# EAGLE design untitledunfinished (EAGLE 9.4.2)
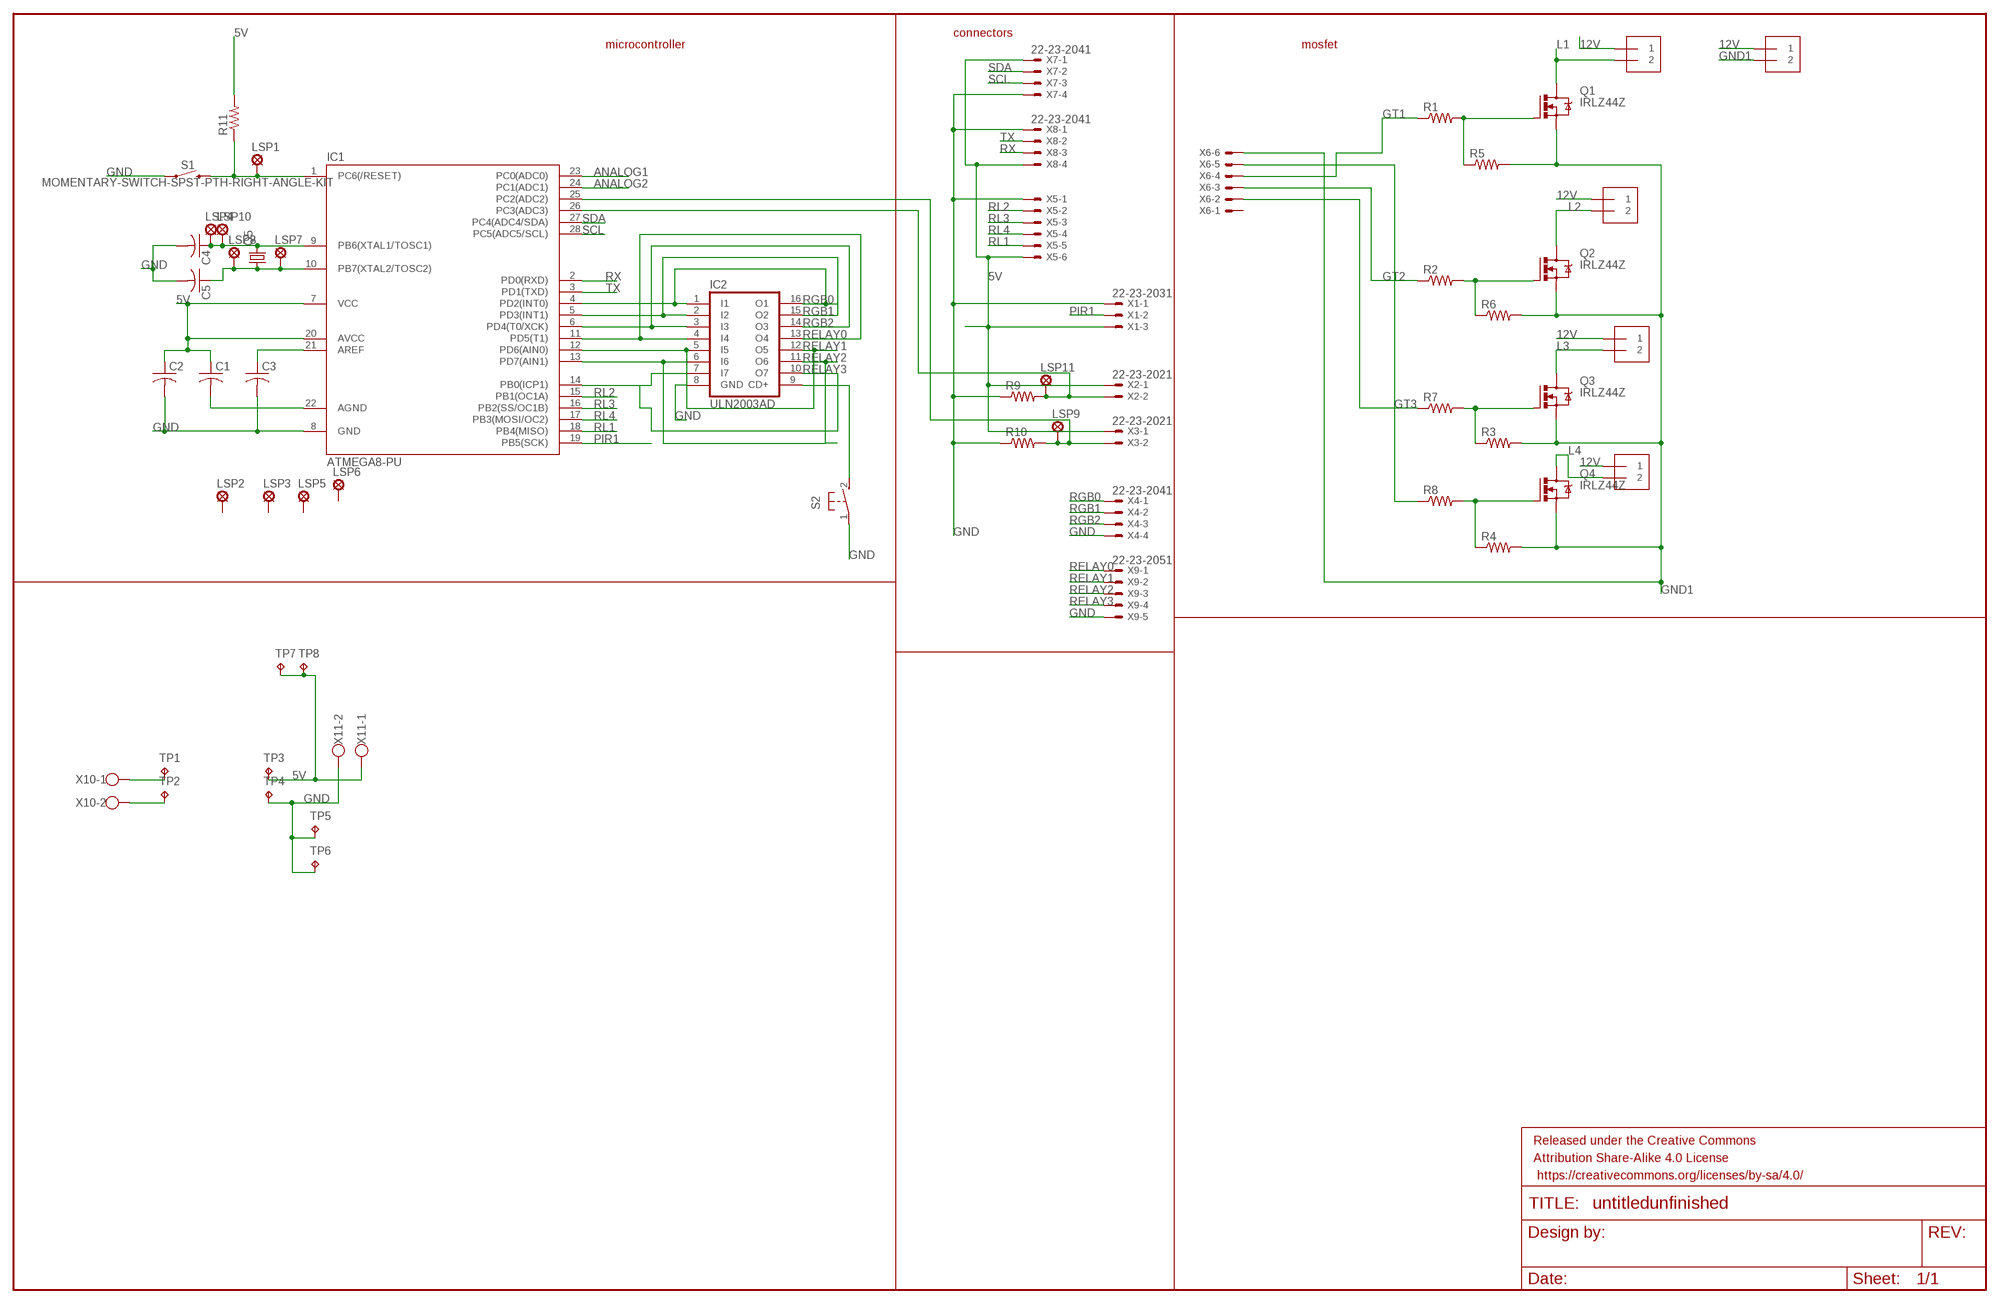
[diagram p0: schematic, sheet 1]

## Parts
C1  C-US050-025X075  [C050-025X075]
C2  C-US050-025X075  [C050-025X075]
C3  C-US050-025X075  [C050-025X075]
C4  C-US050-024X044  [C050-024X044]
C5  C-US050-024X044  [C050-024X044]
FRAME1  FRAME-LEDGER  [CREATIVE_COMMONS]
IC1  ATMEGA8-PU  [DIL28-3]
IC2  ULN2003AD  [SO16]
J1  1X2-3.5MM  [1X2-3.5MM]
J2  1X2-3.5MM  [1X2-3.5MM]
J3  1X2-3.5MM  [1X2-3.5MM]
J4  1X2-3.5MM  [1X2-3.5MM]
J5  1X2-3.5MM  [1X2-3.5MM]
LSP1  SE11  [SE11]
LSP2  SE11  [SE11]
LSP3  SE11  [SE11]
LSP4  SE11  [SE11]
LSP5  SE11  [SE11]
LSP6  SE11  [SE11]
LSP7  SE11  [SE11]
LSP8  SE11  [SE11]
LSP9  SE11  [SE11]
LSP10  SE11  [SE11]
LSP11  SE11  [SE11]
Q1  IRLZ44Z  [TO220BH]
Q2  IRLZ44Z  [TO220BH]
Q3  IRLZ44Z  [TO220BH]
Q4  IRLZ44Z  [TO220BH]
Q5  CRYSTALHC49U-V  [HC49U-V]
R1  R-US_0207/10  [0207/10]
R2  R-US_0207/10  [0207/10]
R3  R-US_0207/10  [0207/10]
R4  R-US_0207/10  [0207/10]
R5  R-US_0207/10  [0207/10]
R6  R-US_0207/10  [0207/10]
R7  R-US_0207/10  [0207/10]
R8  R-US_0207/10  [0207/10]
R9  R-US_0207/15  [0207/15]
R10  R-US_0207/15  [0207/15]
R11  R-US_0207/10  [0207/10]
S1  MOMENTARY-SWITCH-SPST-PTH-RIGHT-ANGLE-KIT  [TACTILE_SWITCH_PTH_RIGHT_ANGLE_KIT]
S2  31-XX  [B3F-31XX]
TP1  TPPAD1-20Y  [P1-20Y]
TP2  TPPAD1-20Y  [P1-20Y]
TP3  TPPAD1-20Y  [P1-20Y]
TP4  TPPAD1-20Y  [P1-20Y]
TP5  TPPAD1-13Y  [P1-13Y]
TP6  TPPAD1-13Y  [P1-13Y]
TP7  TPPAD1-13Y  [P1-13Y]
TP8  TPPAD1-13Y  [P1-13Y]
X1  22-23-2031  [22-23-2031]
X2  22-23-2021  [22-23-2021]
X3  22-23-2021  [22-23-2021]
X4  22-23-2041  [22-23-2041]
X5  22-23-2061  [22-23-2061]
X6  22-23-2061  [22-23-2061]
X7  22-23-2041  [22-23-2041]
X8  22-23-2041  [22-23-2041]
X9  22-23-2051  [22-23-2051]
X10  W237-102  [W237-102]
X11  W237-102  [W237-102]

## Nets
5V: C1.1 C2.1 IC1.7(VCC) IC1.20(AVCC) R11.2 TP3.TP TP7.TP TP8.TP X1.3 X2.1 X3.1 X5.6 X7.1 X8.4 X11.1
12V: J1.1 J2.1 J3.1 J4.1 J5.1
ANALOG1: IC1.23(PC0(ADC0))
ANALOG2: IC1.24(PC1(ADC1))
GND: C2.2 C3.2 C4.2 C5.2 IC1.8(GND) IC2.8(GND) R9.1 R10.1 S1.1 S2.1(P) TP4.TP TP5.TP TP6.TP X1.1 X4.4 X5.1 X7.4 X8.1 X9.5 X11.2
GND1: J5.2 Q1.S Q2.S Q3.S Q4.S R3.2 R4.2 R5.2 R6.2 X6.6
GT1: R1.1 X6.4
GT2: R2.1 X6.3
GT3: R7.1 X6.2
L1: J1.2 Q1.D
L2: J2.2 Q2.D
L3: J3.2 Q3.D
L4: J4.2 Q4.D
N$1: Q1.G R1.2 R5.1
N$2: R8.1 X6.5
N$3: Q2.G R2.2 R6.1
N$4: C1.2 IC1.22(AGND)
N$5: Q3.G R3.1 R7.2
N$6: C3.1 IC1.21(AREF)
N$7: Q4.G R4.1 R8.2
N$8: TP1.TP X10.1
N$9: IC1.25(PC2(ADC2)) LSP9.MP R10.2 X3.2
N$10: IC1.1(PC6(/RESET)) LSP1.MP R11.1 S1.2
N$11: C4.1 IC1.9(PB6(XTAL1/TOSC1)) LSP4.MP LSP10.MP Q5.2
N$12: C5.1 IC1.10(PB7(XTAL2/TOSC2)) LSP7.MP LSP8.MP Q5.1
N$15: IC2.9(CD+) S2.2(S)
N$17: IC1.26(PC3(ADC3)) LSP11.MP R9.2 X2.2
N$18: TP2.TP X10.2
PIR1: IC1.19(PB5(SCK)) X1.2
RELAY0: IC1.11(PD5(T1)) IC2.4(I4) IC2.13(O4) X9.1
RELAY1: IC1.12(PD6(AIN0)) IC2.5(I5) IC2.12(O5) X9.2
RELAY2: IC1.13(PD7(AIN1)) IC2.6(I6) IC2.11(O6) X9.3
RELAY3: IC1.14(PB0(ICP1)) IC2.7(I7) IC2.10(O7) X9.4
RGB0: IC1.4(PD2(INT0)) IC2.1(I1) IC2.16(O1) X4.1
RGB1: IC1.5(PD3(INT1)) IC2.2(I2) IC2.15(O2) X4.2
RGB2: IC1.6(PD4(T0/XCK)) IC2.3(I3) IC2.14(O3) X4.3
RL1: IC1.18(PB4(MISO)) X5.5
RL2: IC1.15(PB1(OC1A)) X5.2
RL3: IC1.16(PB2(SS/OC1B)) X5.3
RL4: IC1.17(PB3(MOSI/OC2)) X5.4
RX: IC1.2(PD0(RXD)) X8.3
SCL: IC1.28(PC5(ADC5/SCL)) X7.3
SDA: IC1.27(PC4(ADC4/SDA)) X7.2
TX: IC1.3(PD1(TXD)) X8.2
Unconnected: LSP2.MP LSP3.MP LSP5.MP LSP6.MP X6.1

## Notes on the sheet
- connectors
- microcontroller | mosfet

## Library data of the parts
C1-C5 = adafruit:C-US: CAPACITOR, American symbol
FRAME1 = SparkFun-Aesthetics:FRAME-LEDGER: Schematic Frame - Ledger Standard 11x14 US Ledger frame
IC1 = atmega8:ATMEGA8-PU
IC2 = uln-udn:ULN2003A: DRIVER ARRAY
J1-J5 = adafruit:1X2: 3.5mm Terminal block http://www.ladyada.net/library/pcb/eaglelibrary.html
LSP1-LSP11 = solpad:SE11: SOLDER PAD RTM, drill 1,1mm, distributor Buerklin, 07F810
Q1-Q4 = transistor-power:IRLZ44Z: N-Channel HEXFET® Power MOSFET Logic Level AUTOMOTIVE MOSFET Source: http://www.irf.com/product-info/datasheets/data/irlz44zpbf.pdf
Q5 = adafruit:CRYSTAL: CRYSTAL; OC_FARNELL: 1666969; OC_NEWARK: unknown
R1-R11 = adafruit:R-US_: RESISTOR, American symbol
S1 = SparkFun-Switches:MOMENTARY-SWITCH-SPST: Momentary Switch (Pushbutton) - SPST Normally-open (NO) SPST momentary switches (buttons, pushbuttons). Variants PTH-12MM - 12mm square, through-hole Momentary Pushbutton Switch - 12mm Square <https://www.sparkfun.com/products/9190> (COM-09190) PTH-6.0MM, PTH-6.0MM-KIT - 6.0mm square, through-hole Mini Pushbutton Switch <https://www.sparkfun.com/products/97> (COM-00097) KIT package intended for soldering kit's - only one side of pads' copper is exposed. PTH-RIGHT-ANGLE-KIT - Right-angle, through-hole Right Angle Tactile Button <https://www.sparkfun.com/products/10791> - Used on SparkFun BigTime Watch Kit <https://www.sparkfun.com/products/11734> SMD-12MM - 12mm square, surface-mount Tactile Button - SMD (12mm) <https://www.sparkfun.com/products/12993> (COM-12993) Used on SparkFun PicoBoard <https://www.sparkfun.com/products/11888> SMD-4.5MM - 4.5mm Square Trackball Switch Used on SparkFun Blackberry Trackballer Breakout <https://www.sparkfun.com/products/13169> SMD-4.6MMX2.8MM - 4.60mm x 2.80mm, surface mount Used on SparkFun SAMD21 Mini Breakout <https://www.sparkfun.com/products/13664> SMD-5.2MM, SMD-5.2-REDUNDANT - 5.2mm square, surface-mount Mini Pushbutton Switch - SMD <https://www.sparkfun.com/products/8720> (COM-08720) Used on Arduino Pro Mini <https://www.sparkfun.com/products/11114> REDUNDANT package connects both switch circuits together SMD-6.0X3.5MM - 6.0 x 3.5mm, surface mount Momentary Reset Switch SMD <https://www.sparkfun.com/products/8229> (COM-08229) SMD-6.2MM-TALL - 6.2mm square, surface mount Tactile Button - SMD (6mm) <https://www.sparkfun.com/products/12992> Used on SparkFun Digital Sandbox <https://www.sparkfun.com/products/12651> SMD-RIGHT-ANGLE - Right-angle, surface mount Used on SparkFun Block for Intel® Edison - Arduino <https://www.sparkfun.com/products/13036>; PROD_ID: CONN-10672; SF_SKU: COM-10791
S2 = adafruit:31-XX: OMRON SWITCH Now with beefier pads!
TP1-TP8 = testpad:TP: Test pad
X1 = con-molex:22-23-2031: .100" (2.54mm) Center Header - 3 Pin; MF: MOLEX; MPN: 22-23-2031; OC_FARNELL: 1462950; OC_NEWARK: 30C0862
X2 X3 = con-molex:22-23-2021: .100" (2.54mm) Center Header - 2 Pin; MF: MOLEX; MPN: 22-23-2021; OC_FARNELL: 1462926; OC_NEWARK: 25C3832
X4 X7 X8 = con-molex:22-23-2041: .100" (2.54mm) Center Header - 4 Pin; MF: MOLEX; MPN: 22-23-2041; OC_FARNELL: 1462920; OC_NEWARK: 38C0355
X5 X6 = con-molex:22-23-2061: .100" (2.54mm) Center Header - 6 Pin; MF: MOLEX; MPN: 22-23-2061; OC_FARNELL: 1462922; OC_NEWARK: 27C1933
X9 = con-molex:22-23-2051: .100" (2.54mm) Center Header - 5 Pin; MF: MOLEX; MPN: 22-23-2051; OC_FARNELL: 1462952; OC_NEWARK: 38C9178
X10 X11 = con-wago-500:W237-102: WAGO SCREW CLAMP; MPN: 237-102; OC_FARNELL: unknown; OC_NEWARK: 70K9898

## Board
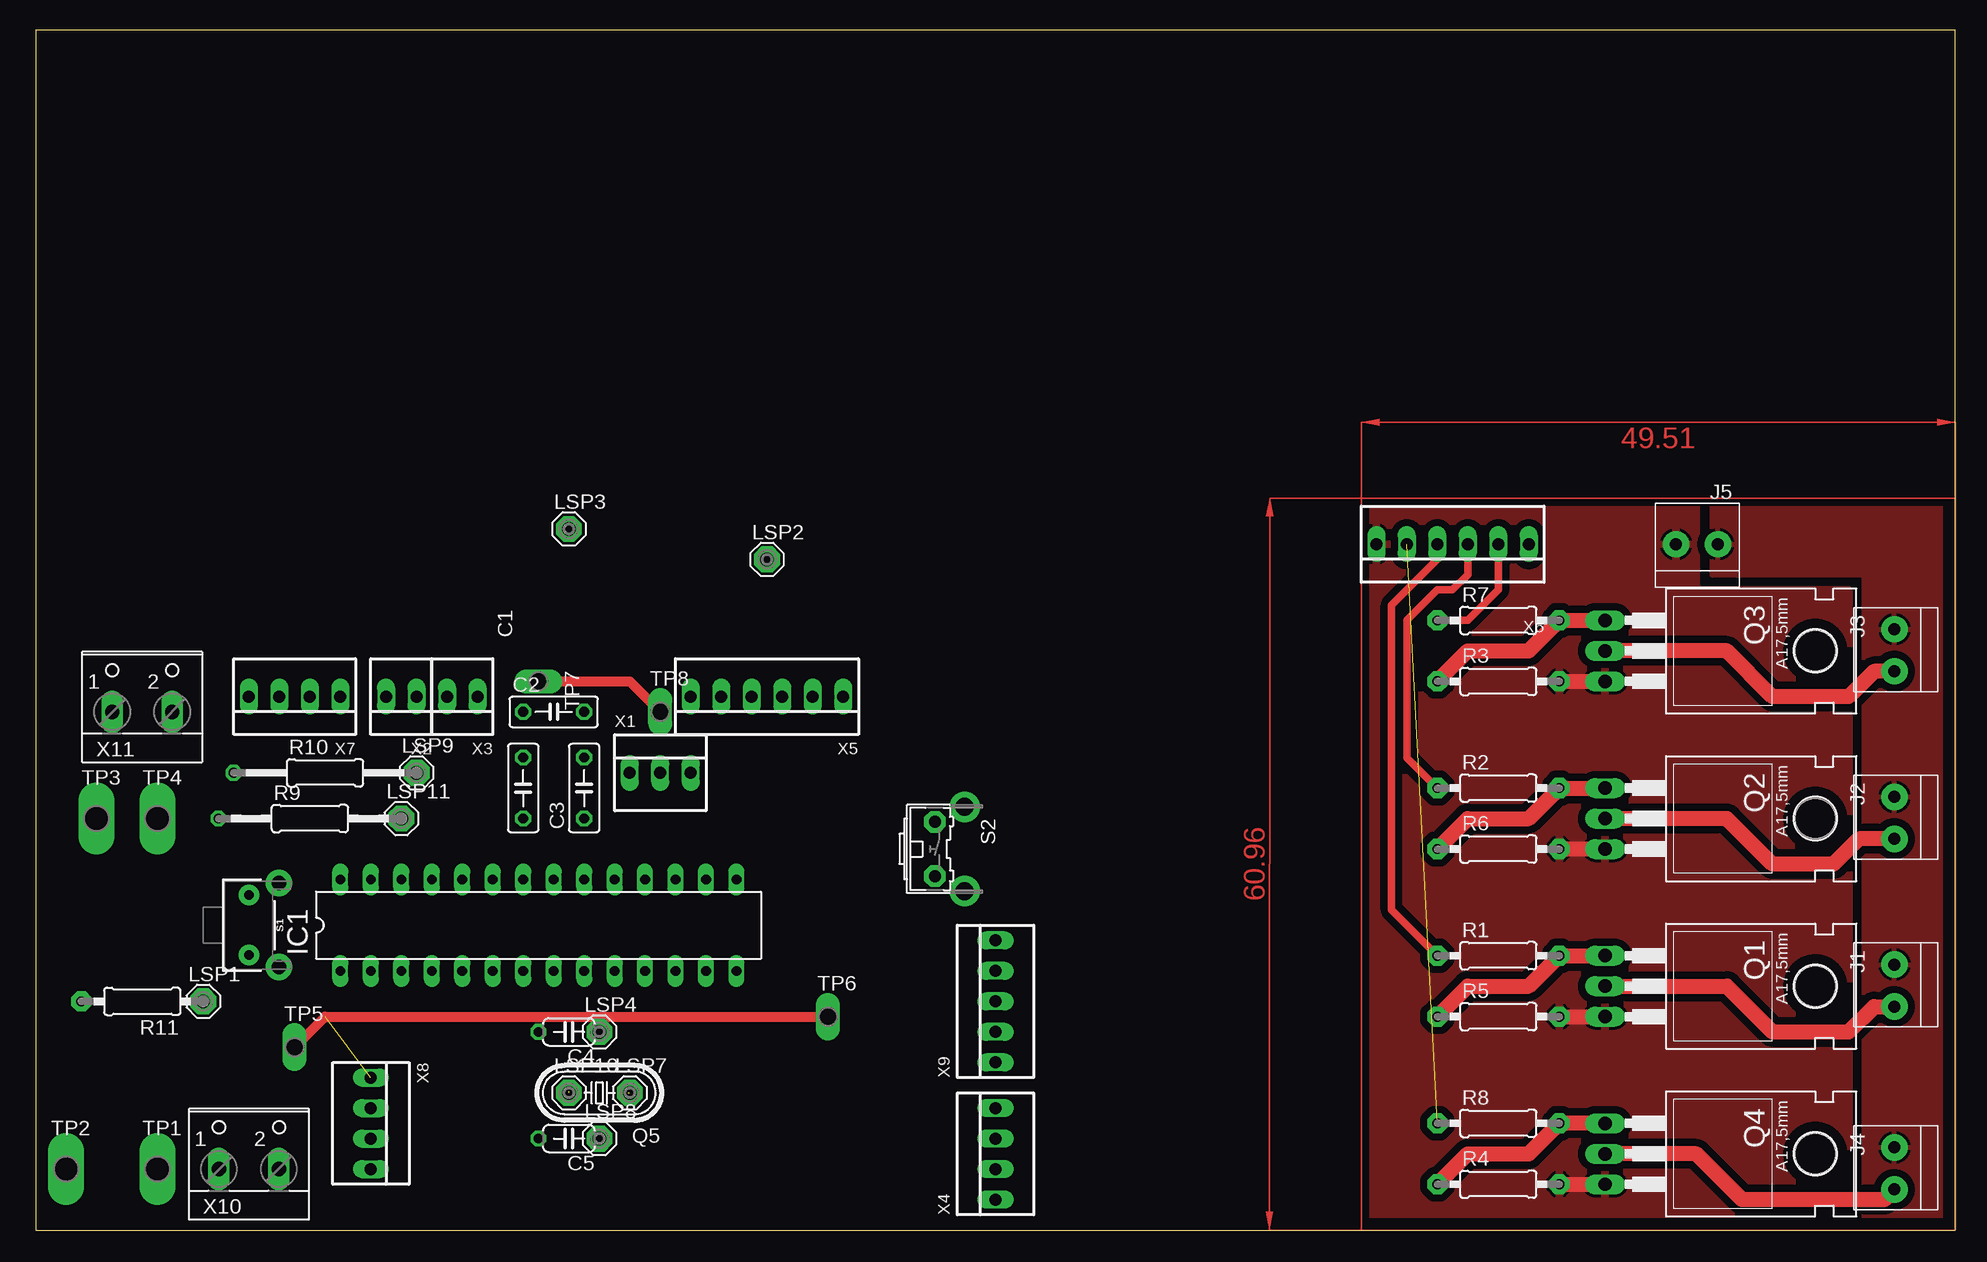
[diagram p1: board, top side]
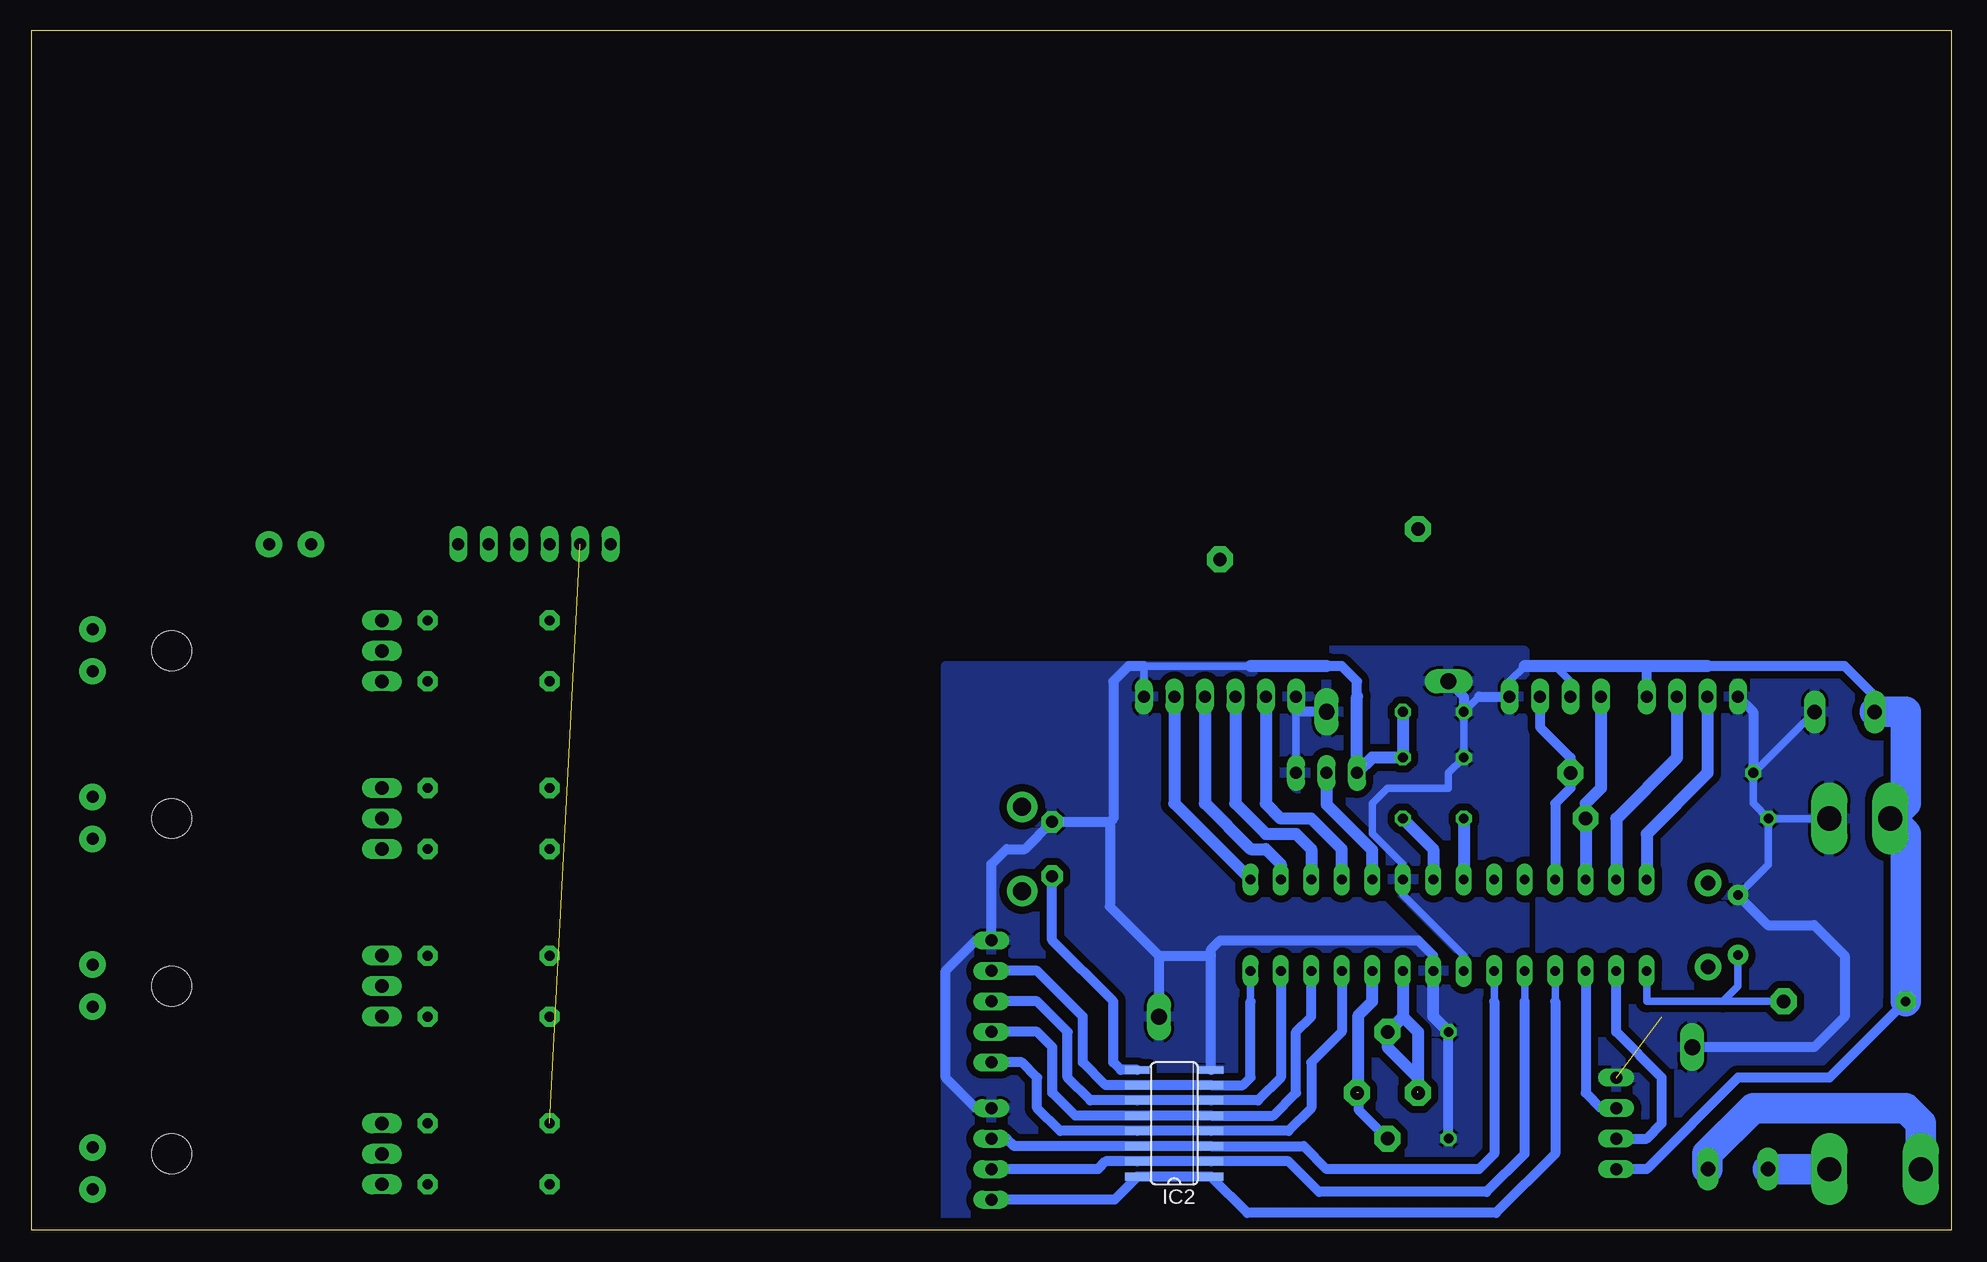
[diagram p2: board, bottom side, seen from below]

Size 160 x 100 mm. Coordinates in mm from the lower left corner, seen from the top.
Outline: 0,0 160,0 160,100 0,100 0,0
Copper layers (1*16): Top 0.035mm / dielectric 1.5mm / Bottom 0.035mm
Design rules "default": minimum track width 6mil, minimum drill 0.35mm, track to track 6mil, track to pad 6mil, pad to pad 6mil, via to via 6mil, smd to smd 6mil, copper to edge 40mil, drill to drill 6mil, minimum pad ring 10mil, minimum via ring 8mil, stop-mask expansion 4mil, vias tented up to drill 0mil, thermal gap 10mil

### Footprints (pad centres in the part's own frame; a part is rotated, then mirrored left to right if it is on the bottom)
C050-025X075 = drill 0.813 octagon: 1 -2.54,0; 2 2.54,0
C050-024X044 = drill 0.813 octagon: 1 -2.54,0; 2 2.54,0
DIL28-3 = drill 0.813 long: 1 -16.51,-3.81; 2 -13.97,-3.81; 3 -11.43,-3.81; 4 -8.89,-3.81; 5 -6.35,-3.81; 6 -3.81,-3.81; 7 -1.27,-3.81; 8 1.27,-3.81; 9 3.81,-3.81; 10 6.35,-3.81; 11 8.89,-3.81; 12 11.43,-3.81; 13 13.97,-3.81; 14 16.51,-3.81; 15 16.51,3.81; 16 13.97,3.81; 17 11.43,3.81; 18 8.89,3.81; 19 6.35,3.81; 20 3.81,3.81; 21 1.27,3.81; 22 -1.27,3.81; 23 -3.81,3.81; 24 -6.35,3.81; 25 -8.89,3.81; 26 -11.43,3.81; 27 -13.97,3.81; 28 -16.51,3.81
SO16 = smd 0.66 x 2.032: 1 -4.445,-3.073; 2 -3.175,-3.073; 3 -1.905,-3.073; 4 -0.635,-3.073; 5 0.635,-3.073; 6 1.905,-3.073; 7 3.175,-3.073; 8 4.445,-3.073; 9 4.445,3.073; 10 3.175,3.073; 11 1.905,3.073; 12 0.635,3.073; 13 -0.635,3.073; 14 -1.905,3.073; 15 -3.175,3.073; 16 -4.445,3.073
1X2-3.5MM = drill 1 pad 2.184: 1 1.8,0; 2 -1.7,0
SE11 = drill 1.118 pad 2.159 octagon: MP 0,0
TO220BH = drill 1.118 long: D 0,-6.35; G -2.54,-6.35; S 2.54,-6.35 | hole 3.302: 0,11.176
HC49U-V = drill 0.813: 1 -2.413,0; 2 2.413,0
0207/10 = drill 0.813 pad 1.676 octagon: 1 -5.08,0; 2 5.08,0
0207/15 = drill 0.813 octagon: 1 -7.62,0; 2 7.62,0
TACTILE_SWITCH_PTH_RIGHT_ANGLE_KIT = drill 0.8 pad 1.7: 1 -2.5,0; 2 2.5,0 | drill 1.2 pad 2.2: ANCHOR1 -3.5,2.5; ANCHOR2 3.5,2.5
B3F-31XX = drill 1.016 pad 1.778 octagon: 1 -2.261,-1.245; 2 2.261,-1.245 | drill 1.499 pad 2.54: 3 -3.505,1.245; 4 3.505,1.245
P1-20Y = drill 2.007 pad 2.54 long: TP 0,0
P1-13Y = drill 1.321 pad 1.905 long: TP 0,0
22-23-2031 = drill 1 long: 1 -2.54,0; 2 0,0; 3 2.54,0
22-23-2021 = drill 1 long: 1 -1.27,0; 2 1.27,0
22-23-2041 = drill 1 long: 1 -3.81,0; 2 -1.27,0; 3 1.27,0; 4 3.81,0
22-23-2061 = drill 1 long: 1 -6.35,0; 2 -3.81,0; 3 -1.27,0; 4 1.27,0; 5 3.81,0; 6 6.35,0
22-23-2051 = drill 1 long: 1 -5.08,0; 2 -2.54,0; 3 0,0; 4 2.54,0; 5 5.08,0
W237-102 = drill 1.194 long: 1 -2.5,-1.27; 2 2.5,-1.27

### Placement (x,y rotation side)
C1  40.64,36.83 270 top
C2  43.18,43.18 0 top
C3  45.72,36.83 90 top
C4  44.45,16.51 180 top
C5  44.45,7.62 180 top
FRAME1  21.59,91.44 0 top
IC1  41.91,25.4 0 top
IC2  64.77,8.89 90 bottom
J1  154.94,20.32 90 top
J2  154.94,34.29 90 top
J3  154.94,48.26 90 top
J4  154.94,5.08 90 top
J5  138.43,57.15 0 top
LSP1  13.97,19.05 0 top
LSP2  60.96,55.88 0 top
LSP3  44.45,58.42 0 top
LSP4  46.99,16.51 0 top
LSP5  -2.54,-24.13 0 top  (outside the outline)
LSP6  -2.54,-29.21 0 top  (outside the outline)
LSP7  49.53,11.43 0 top
LSP8  46.99,7.62 0 top
LSP9  31.75,38.1 0 top
LSP10  44.45,11.43 0 top
LSP11  30.48,34.29 0 top
Q1  137.16,20.32 270 top
Q2  137.16,34.29 270 top
Q3  137.16,48.26 270 top
Q4  137.16,6.35 270 top
Q5  46.99,11.43 180 top
R1  121.92,22.86 0 top
R2  121.92,36.83 0 top
R3  121.92,45.72 0 top
R4  121.92,3.81 0 top
R5  121.92,17.78 0 top
R6  121.92,31.75 0 top
R7  121.92,50.8 0 top
R8  121.92,8.89 0 top
R9  22.86,34.29 0 top
R10  24.13,38.1 0 top
R11  8.89,19.05 180 top
S1  17.78,25.4 270 top
S2  76.2,31.75 270 top
TP1  10.16,5.08 0 top
TP2  2.54,5.08 0 top
TP3  5.08,34.29 0 top
TP4  10.16,34.29 0 top
TP5  21.59,15.24 0 top
TP6  66.04,17.78 0 top
TP7  41.91,45.72 270 top
TP8  52.07,43.18 0 top
X1  52.07,38.1 0 top
X2  30.48,44.45 180 top
X3  35.56,44.45 180 top
X4  80.01,6.35 90 top
X5  60.96,44.45 180 top
X6  118.11,57.15 180 top
X7  21.59,44.45 180 top
X8  27.94,8.89 270 top
X9  80.01,19.05 90 top
X10  17.78,6.35 0 top
X11  8.89,44.45 0 top

### Tracks (layer width: path | path; a pad name or v marks a point on that pad's centre or on a via)
5V
  Top 0.813: TP7.TP 49.53,45.72 TP8.TP
  Bottom 0.61: IC1.7 40.64,22.86 45.72,27.94 IC1.20 45.72,30.48 48.26,33.02 48.26,35.56 46.99,36.83 41.91,36.83 41.91,38.1 C1.1 C2.1 39.37,44.45 | X1.3 54.61,43.18 X5.6 | X2.1 31.75,45.72 33.02,46.99 | 33.02,46.99 35.56,46.99 36.83,45.72 X3.1 | 19.05,46.99 20.32,46.99 25.4,46.99 33.02,46.99
  Bottom 0.813: X11.1 6.39,44.49 8.89,46.99 20.32,46.99 | X7.1 25.4,46.99 | R11.2 10.16,12.7 17.78,12.7 25.4,5.08 X8.4 | TP7.TP 40.64,44.45 C2.1 | 39.37,44.45 X3.1 | TP8.TP 54.61,43.18
  Bottom 1.016: 20.32,46.99 35.56,46.99
  Bottom 2.54: X11.1 3.81,43.18 3.81,35.56 TP3.TP 3.81,33.02 R11.2
  pour Bottom (isolate 0.61): 35.56,48.26 55.88,48.26 55.88,38.1 54.61,36.83 52.07,36.83 46.99,31.75 46.99,29.21 40.64,22.86 35.56,22.86
12V
  pour Top (isolate 0.61): 139.7,60.96 139.7,54.61 152.4,54.61 152.4,0 160.02,0 160.02,60.96
GND  (1 unrouted)
  Top 0.813: TP5.TP 24.13,17.78 TP6.TP
  Bottom 0.61: 43.18,22.86 IC1.8 | 58.42,46.99 67.31,46.99 X5.1 | R9.1 16.51,35.56 R10.1 16.47,38.1 X11.2 | R9.1 TP4.TP | S1.1 15.24,30.44 R9.1
  Bottom 0.813: IC2.8 61.7,22.86 | 61.7,22.86 61.7,23.39 60.96,24.13 44.45,24.13 43.18,22.86 | X4.4 81.28,10.16 83.82,12.7 83.82,21.59 81.28,24.13 X9.5 80.01,30.48 78.74,31.75 77.22,31.75 S2.1 70.13,34.01 | C5.2 C4.2 | 67.31,46.99 68.58,46.99 69.85,45.72 69.85,34.29 70.13,34.01 | X7.4 16.51,43.18 R10.1 | 70.13,34.01 70.13,26.95 66.04,22.86 | 66.04,22.86 61.7,22.86 | S1.1 15.28,25.4 11.43,25.4 8.89,22.86 8.89,17.78 11.43,15.24 TP5.TP | 66.04,22.86 TP6.TP | 52.07,46.99 50.8,46.99 49.53,45.72 49.53,44.45
  Bottom 1.016: C4.2 43.18,17.78 IC1.8 | C2.2 C3.2 48.26,39.37 X1.1 49.53,44.45 | 52.07,46.99 58.42,46.99
  pour Bottom (isolate 0.61): 43.18,21.59 43.18,22.86 49.53,29.21 49.53,31.75 53.34,35.56 55.88,35.56 57.15,36.83 57.15,45.72 58.42,46.99 82.55,46.99 83.82,46.99 83.82,0 0,0 0,48.26 34.29,48.26 34.29,21.59
GND1
  Top 1.27: R4.2 Q4.S | R5.2 Q1.S | Q2.S R6.2 | R3.2 Q3.S
  pour Top (isolate 0.61): 138.43,58.42 138.43,53.34 151.13,53.34 151.13,0 110.49,0 110.49,60.96 138.43,60.96
GT1
  Top 0.61: R1.1 113.03,26.67 113.03,52.07 116.84,55.88 X6.4
GT2
  Top 0.61: X6.3 119.38,54.61 118.11,53.34 116.84,53.34 114.3,50.8 114.3,39.37 R2.1
GT3
  Top 0.61: X6.2 121.92,53.34 119.38,50.8 R7.1
L1
  Top 1.27: Q1.D 140.97,20.32 144.78,16.51 151.13,16.51 153.24,18.62 J1.2
L2
  Top 1.27: J2.2 151.97,32.59 149.86,30.48 144.78,30.48 140.97,34.29 Q2.D
L3
  Top 1.27: J3.2 153.24,46.56 151.13,44.45 144.78,44.45 140.97,48.26 Q3.D
L4
  Top 1.27: J4.2 154.1,2.54 142.24,2.54 138.43,6.35 Q4.D
N$1
  Top 1.27: R5.1 119.38,20.32 124.46,20.32 R1.2 Q1.G
N$2  (1 unrouted)
N$3
  Top 1.27: R6.1 119.38,34.29 124.46,34.29 R2.2 Q2.G
N$4
  Bottom 1.016: C1.2 IC1.22
N$5
  Top 1.27: R3.1 119.38,48.26 124.46,48.26 R7.2 Q3.G
N$6
  Bottom 1.016: C3.1 43.18,31.75 IC1.21
N$7
  Top 1.27: R4.1 119.38,6.35 124.46,6.35 R8.2 Q4.G
N$8
  Bottom 2.54: TP1.TP X10.1
N$9
  Bottom 0.61: 33.02,30.48 IC1.25
  Bottom 0.813: X3.2 34.29,41.91 31.75,39.37 LSP9.MP 31.75,36.83 33.02,35.56 IC1.25
N$10
  Bottom 0.61: IC1.1 25.4,19.05 19.05,19.05 | S1.2 17.78,20.32 19.05,19.05 | LSP1.MP 19.05,19.05
N$11  (1 unrouted)
  Bottom 1.016: 45.72,17.78 LSP4.MP 46.99,15.24 44.45,12.7 | IC1.9 45.72,17.78 | 44.45,12.7 44.45,11.56 Q5.2 | 45.72,17.78 44.45,16.51 44.45,12.7
N$12  (1 unrouted)
  Bottom 0.813: Q5.1 49.4,10.03 LSP8.MP
  Bottom 1.016: Q5.1 49.4,17.91 48.26,19.05 IC1.10
N$15
  Bottom 0.813: IC2.9 69.22,13.34 69.85,13.97 69.85,19.05 74.95,24.16 S2.2
N$17
  Bottom 0.61: 30.48,35.56 LSP11.MP
  Bottom 1.016: X2.2 29.21,36.83 30.48,35.56 | LSP11.MP IC1.26
N$18
  Bottom 0.61: 20.32,5.08 X10.2
  Bottom 2.54: TP2.TP 2.54,8.89 3.81,10.16 16.51,10.16 20.32,6.35 20.32,5.08
PIR1
  Bottom 1.016: IC1.19 48.26,31.66 52.07,35.47 X1.2
RELAY0
  Bottom 0.813: X9.1 77.47,13.97 76.2,12.7 76.2,10.16 74.3,8.26 IC2.13 IC2.4 55.24,8.26 53.34,10.16 53.34,13.97 50.8,16.51 IC1.11
RELAY1
  Bottom 0.813: X9.2 76.2,16.51 74.93,15.24 74.93,11.43 73.03,9.53 IC2.12 IC2.5 56.52,9.53 54.61,11.43 54.61,16.51 53.34,17.78 IC1.12
RELAY2
  Bottom 0.61: 55.88,20.32 IC1.13
  Bottom 0.813: X9.3 76.2,19.05 73.66,16.51 73.66,12.7 71.75,10.79 IC2.11 IC2.6 57.78,10.79 55.88,12.7 IC1.13
RELAY3
  Bottom 0.61: 58.42,19.05 IC1.14
  Bottom 0.813: X9.4 76.2,21.59 72.39,17.78 72.39,13.97 70.48,12.06 IC2.10 IC2.7 59.05,12.06 58.42,12.7 58.42,19.05
RGB0
  Bottom 0.61: IC1.4 33.02,19.05
  Bottom 0.813: X4.1 69.75,2.54 IC2.16 IC2.1 58.67,1.42 37.95,1.42 33.02,6.35 33.02,19.05
RGB1
  Bottom 0.61: 35.56,19.05 IC1.5
  Bottom 0.813: X4.2 71.12,5.08 70.48,5.71 IC2.15 IC2.2 55.24,5.71 52.7,3.17 38.73,3.17 35.56,6.35 35.56,19.05
RGB2
  Bottom 0.61: IC1.6 38.1,19.05
  Bottom 0.813: X4.3 78.74,7.62 78.11,6.99 IC2.14 IC2.3 53.98,6.99 52.07,5.08 39.37,5.08 38.1,6.35 38.1,19.05
RL1
  Bottom 1.016: X5.5 57.15,35.56 55.88,34.29 53.34,34.29 50.8,31.75 IC1.18 50.8,30.48
RL2
  Bottom 1.016: X5.2 64.77,35.56 IC1.15
RL3
  Bottom 1.016: X5.3 62.23,35.56 58.42,31.75 57.15,31.75 55.88,30.48 IC1.16
RL4
  Bottom 1.016: X5.4 59.69,35.56 57.15,33.02 54.61,33.02 53.34,31.75 IC1.17
RX
  Bottom 0.813: X8.3 25.4,7.62 24.13,8.89 24.13,12.7 27.94,16.51 IC1.2
SCL
  Bottom 1.016: X7.3 20.32,38.1 25.4,33.02 IC1.28
SDA
  Bottom 1.016: X7.2 22.86,39.37 27.94,34.29 IC1.27
TX
  Bottom 0.813: X8.2 29.21,10.16 30.48,11.43 IC1.3
(copper drawn outside any net)
  shapes: Top area x2